# Altium schematic sheet Filter Section.SchDoc
size B
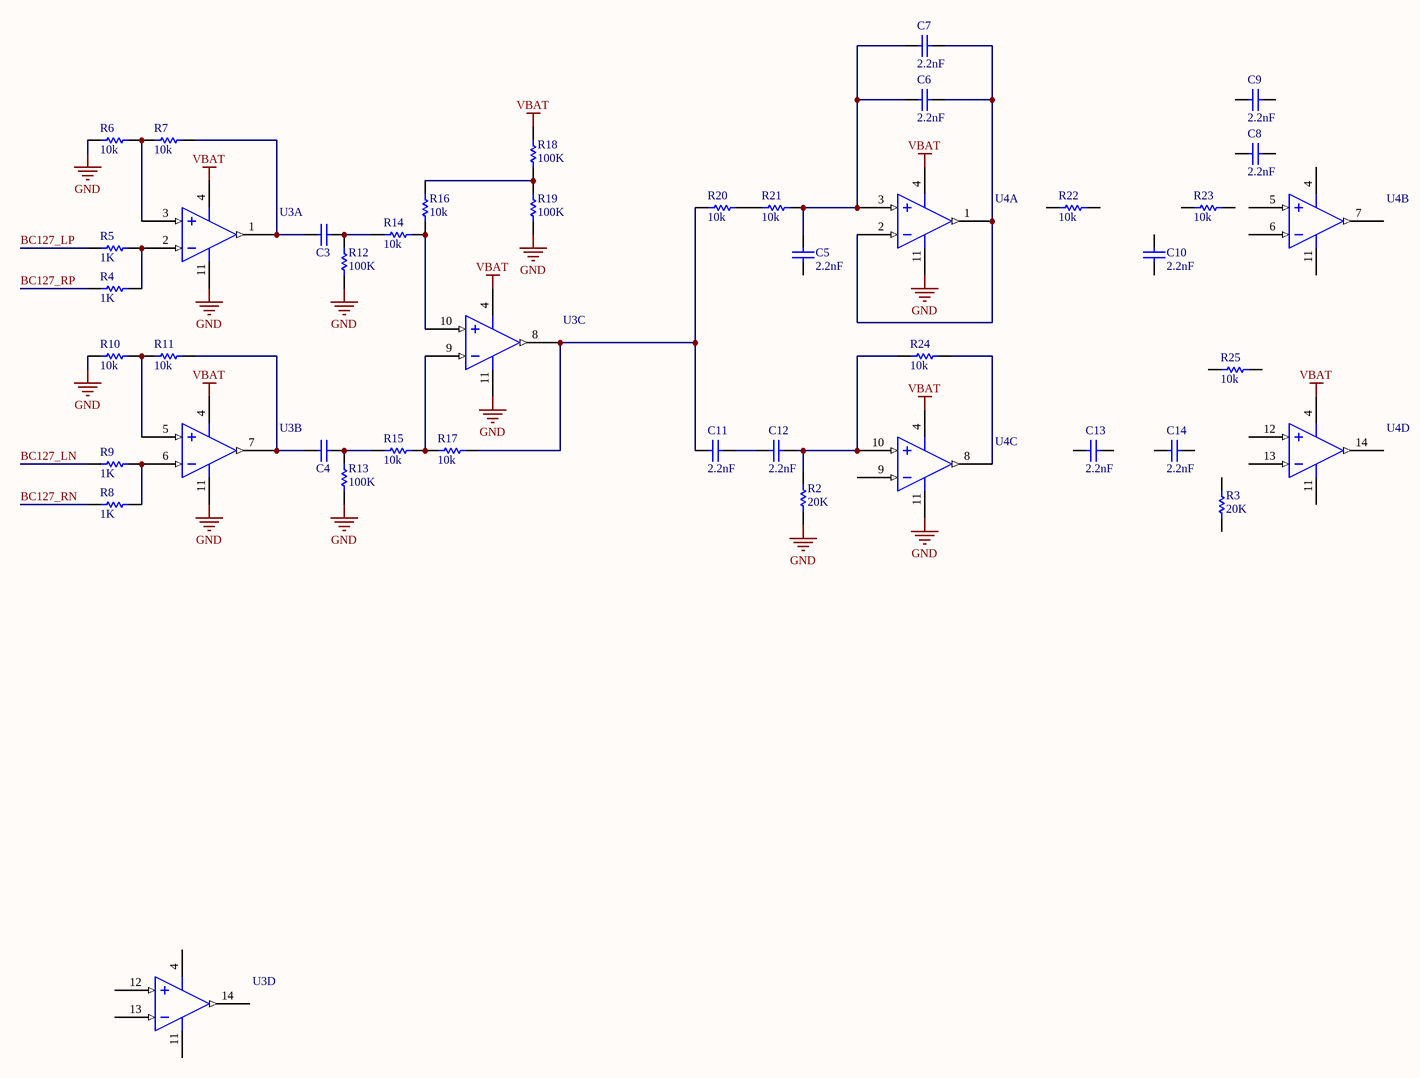
[diagram p0: Filter Section.SchDoc]

## Parts
C3  1uf  (value not drawn)
C4  1uf  (value not drawn)
C5  2.2nF  [CAPC1608X09N]
C6  2.2nF  [CAPC1608X09N]
C7  2.2nF  [CAPC1608X09N]
C8  2.2nF  [CAPC1608X09N]
C9  2.2nF  [CAPC1608X09N]
C10  2.2nF  [CAPC1608X09N]
C11  2.2nF  [CAPC1608X09N]
C12  2.2nF  [CAPC1608X09N]
C13  2.2nF  [CAPC1608X09N]
C14  2.2nF  [CAPC1608X09N]
R2  20K  [RESC1608X06N]
R3  20K  [RESC1608X06N]
R4  1K  [RESC1608X06N]
R5  1K  [RESC1608X06N]
R6  10k  [RESC1608X06N]
R7  10k  [RESC1608X06N]
R8  1K  [RESC1608X06N]
R9  1K  [RESC1608X06N]
R10  10k  [RESC1608X06N]
R11  10k  [RESC1608X06N]
R12  100K  [RESC1608X06N]
R13  100K  [RESC1608X06N]
R14  10k  [RESC1608X06N]
R15  10k  [RESC1608X06N]
R16  10k  [RESC1608X06N]
R17  10k  [RESC1608X06N]
R18  100K  [RESC1608X06N]
R19  100K  [RESC1608X06N]
R20  10k  [RESC1608X06N]
R21  10k  [RESC1608X06N]
R22  10k  [RESC1608X06N]
R23  10k  [RESC1608X06N]
R24  10k  [RESC1608X06N]
R25  10k  [RESC1608X06N]
U3  OPA4134UA  [SOIC127P600X175-14N]  (value not drawn)  (parts A,B,C,D of 4)
U4  OPA4134UA  [SOIC127P600X175-14N]  (value not drawn)  (parts A,B,C,D of 4)

## Nets
GND: R2.1 R6.1 R10.1 R12.1 R13.1 R19.1
VBAT: R18.2
BC127_LN: R9.1
BC127_LP: R5.1
BC127_RN: R8.1
BC127_RP: R4.1
NetC3_1: C3.1 R7.2 U3.1(Out_A)
NetC3_2: C3.2 R12.2 R14.1
NetC4_1: C4.1 R11.2 U3.7(Out_B)
NetC4_2: C4.2 R13.2 R15.1
NetC5_2: C5.2 C6.1 C7.1 R21.2 U4.3(+In_A)
NetC6_2: C6.2 C7.2 U4.1(Out_A) U4.2(-In_A)
NetC11_1: C11.1 R17.1 R20.1 U3.8(Out_C)
NetC11_2: C11.2 C12.1
NetC12_2: C12.2 R2.2 R24.1 U4.10(+In_C)
NetR4_2: R4.2 R5.2 U3.2(-In_A)
NetR6_2: R6.2 R7.1 U3.3(+In_A)
NetR8_2: R8.2 R9.2 U3.6(-In_B)
NetR10_2: R10.2 R11.1 U3.5(+In_B)
NetR14_2: R14.2 R16.1 U3.10(+In_C)
NetR15_2: R15.2 R17.2 U3.9(-In_C)
NetR16_2: R16.2 R18.1 R19.2
NetR20_2: R20.2 R21.1
NetR24_2: R24.2 U4.8(Out_C)

Not connected (* = marked no-connect by the designer): C5 1; C8 1 2; C9 1 2; C10 1 2; C13 1 2; C14 1 2; R3 1 2; R22 1 2; R23 1 2; R25 1 2; U3 4(V+) 11(V-) 12(+In_D) 13(-In_D) 14(Out_D); U4 4(V+) 5(+In_B) 6(-In_B) 7(Out_B) 9(-In_C) 11(V-) 12(+In_D) 13(-In_D) 14(Out_D)

## Notes on the sheet
- Labels drawn without touching a wire or pin: GND, VBAT

## Library data of the parts
C3 C4 = CAP Radial 5mm: Manufacturer: EPCOS (TDK); Manufacturer P/N: B32529C105J; Voltage: 63V; Value: 1uf; Digikey Part Number: 495-1119-ND
C5-C14 = CAP 2.2nF 0603: Capacitor 2.2nF 0603; Value: 2.2nF; Digikey Part Number: PCF1300CT-ND
R2 R3 = RES 20K 0603: Tolerance: 1%; Power: 0.1W; Footprint: 0603; Value: 20K
R4 R5 R8 R9 = RES 1K 0603: Manufacturer: Panasonic; Manufacturer Part Number: ERJ-PA3F1001V; Tolerance: 1%; Power: 0.25W; Type: RES; Footprint: 0603; Temperature: 155dC; Digikey Part Number: P1.0KBYCT-ND; Value: 1K
R6 R7 R10 R11 R14-R17 R20-R25 = RES 10K 0603: Manufacturer: Yageo; Manufacturer Part Number: RC0603FR-0710KL; Tolerance: 1%; Power: 0.1W; Type: RES; Footprint: 0603; Temperature: 155dC; Digikey Part Number: 311-10.0KHRCT-ND; Value: 10k
R12 R13 R18 R19 = RES 100K 0603: Tolerance: 1%; Power: 0.1W; Footprint: 0603; Value: 100K
U3 U4 = OPA4134UA: Quad OPAx134 Operational Amplifier